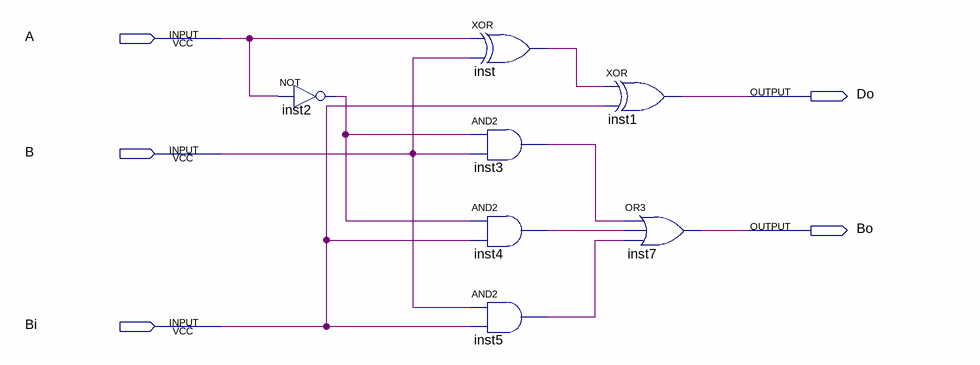
[diagram p0: schematic sheet]
// Quartus schematic Full_Subtractor.bdf as structural Verilog: 7 symbols, 5 pins
module Full_Subtractor (
  input  A,
  input  B,
  input  Bi,
  output Do,
  output Bo
);

  wire inst2_out, inst3_out, inst4_out, inst5_out, inst_out;

  not inst2 (inst2_out, A);
  xor inst (inst_out, A, B);
  and inst3 (inst3_out, inst2_out, B);
  and inst4 (inst4_out, inst2_out, Bi);
  and inst5 (inst5_out, B, Bi);
  xor inst1 (Do, inst_out, Bi);
  or inst7 (Bo, inst3_out, inst4_out, inst5_out);
endmodule
